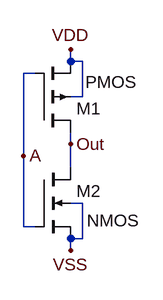
[diagram p0: schematic NOT.asc]
NOT.asc, the LTspice schematic file:
Version 4
SHEET 1 880 680
WIRE 256 32 256 16
WIRE 272 32 256 32
WIRE 208 48 192 48
WIRE 272 80 272 32
WIRE 272 80 256 80
WIRE 256 144 256 128
WIRE 192 160 192 48
WIRE 256 176 256 144
WIRE 272 224 256 224
WIRE 192 256 192 160
WIRE 208 256 192 256
WIRE 272 272 272 224
WIRE 272 272 256 272
WIRE 256 288 256 272
FLAG 256 288 VSS
FLAG 256 16 VDD
FLAG 192 160 A
FLAG 256 144 Out
SYMBOL pmos4 208 128 M180
WINDOW 3 68 68 Left 2
SYMATTR InstName M1
SYMATTR Value2 l=500n w=2u
SYMBOL nmos4 208 176 R0
WINDOW 3 70 72 Left 2
SYMATTR InstName M2

The netlist it stands for:
* NOT.asc
M1 Out A VDD VDD PMOS l=500n w=2u
M2 Out A VSS VSS NMOS
.model NMOS NMOS
.model PMOS PMOS
.lib standard.mos
.backanno
.end